# EAGLE design Projeto Lora (EAGLE 9.6.2)
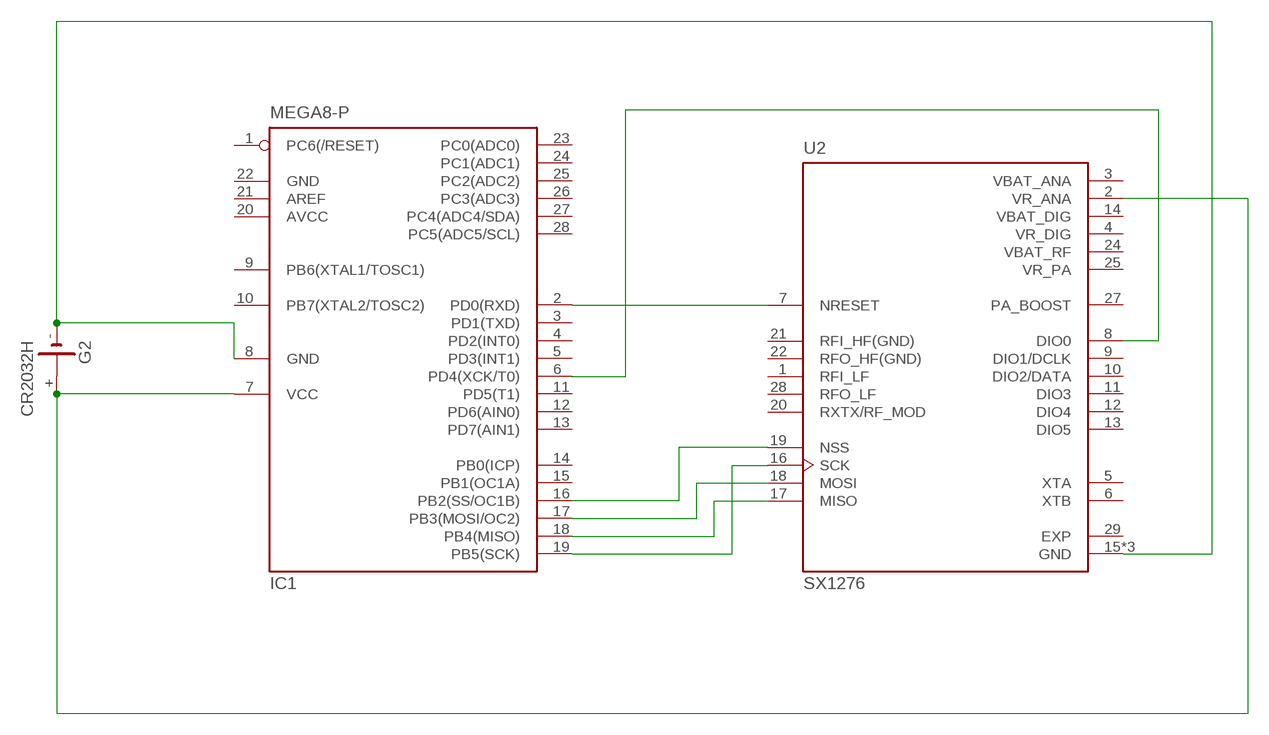
[diagram p0: schematic, sheet 1]

## Parts
G2  CR2032H  [CR2032H]
IC1  MEGA8-P  [DIL28-3]
U2  SX1276  [QFN65P600X600X100-29N]

## Nets
N$1: IC1.18(PB4(MISO)) U2.17(MISO)
N$2: IC1.17(PB3(MOSI/OC2)) U2.18(MOSI)
N$3: IC1.16(PB2(SS/OC1B)) U2.19(NSS)
N$5: IC1.19(PB5(SCK)) U2.16(SCK)
N$8: G2.+ IC1.7(VCC) U2.2(VR_ANA)
N$11: IC1.2(PD0(RXD)) U2.7(NRESET)
N$15: G2.- IC1.8(GND) U2.15(GND) U2.23(GND) U2.26(GND)
N$16: IC1.6(PD4(XCK/T0)) U2.8(DIO0)
Unconnected: G2.+@1(+) IC1.1(PC6(/RESET)) IC1.3(PD1(TXD)) IC1.4(PD2(INT0)) IC1.5(PD3(INT1)) IC1.9(PB6(XTAL1/TOSC1)) IC1.10(PB7(XTAL2/TOSC2)) IC1.11(PD5(T1)) IC1.12(PD6(AIN0)) IC1.13(PD7(AIN1)) IC1.14(PB0(ICP)) IC1.15(PB1(OC1A)) IC1.21(AREF) IC1.23(PC0(ADC0)) IC1.24(PC1(ADC1)) IC1.25(PC2(ADC2)) IC1.26(PC3(ADC3)) IC1.27(PC4(ADC4/SDA)) IC1.28(PC5(ADC5/SCL)) U2.1(RFI_LF) U2.5(XTA) U2.6(XTB) U2.9(DIO1/DCLK) U2.10(DIO2/DATA) U2.11(DIO3) U2.12(DIO4) U2.13(DIO5) U2.20(RXTX/RF_MOD) U2.21(RFI_HF(GND)) U2.22(RFO_HF(GND)) U2.27(PA_BOOST) U2.28(RFO_LF)

## Power pins joined to a net without a drawn wire
AVCC: IC1.20(AVCC)
EXP: U2.29(EXP)
GND: IC1.22(GND)
VBAT_ANA: U2.3(VBAT_ANA)
VBAT_DIG: U2.14(VBAT_DIG)
VBAT_RF: U2.24(VBAT_RF)
VR_DIG: U2.4(VR_DIG)
VR_PA: U2.25(VR_PA)

## Library data of the parts
G2 = battery:CR2032H: LI BATTERY Varta
IC1 = atmel:MEGA8-P: MICROCONTROLLER 8 Kbytes FLASH, 1 kbytes SRAM, 512 bytes EEPROM, USART, 4-channel 10 bit ADC, 2-channel 8 bit ADC Pin compatible with Atmega48, ATMega88, ATMega168 Source: avr.lbr; OC_FARNELL: unknown; OC_NEWARK: unknown
U2 = SX1276:SX1276: RF Transceiver FSK/GFSK/MSK/GMSK/LoRa/OOK 137MHz to 1020MHz 28-Pin QFN Check prices <https://pricing.snapeda.com/parts/SX1276/Semtech%20Corporation/view-part?ref=eda>; AVAILABILITY: In Stock; DESCRIPTION: IC RF TxRx Only 802.15.4 LoRa™ 137MHz ~ 1.02GHz 28-VQFN Exposed Pad; MF: Semtech Corporation; MP: SX1276; PACKAGE: VQFN-28 Semtech Corporation; PRICE: None; PURCHASE-URL: https://pricing.snapeda.com/search/part/SX1276/?ref=eda

## Board
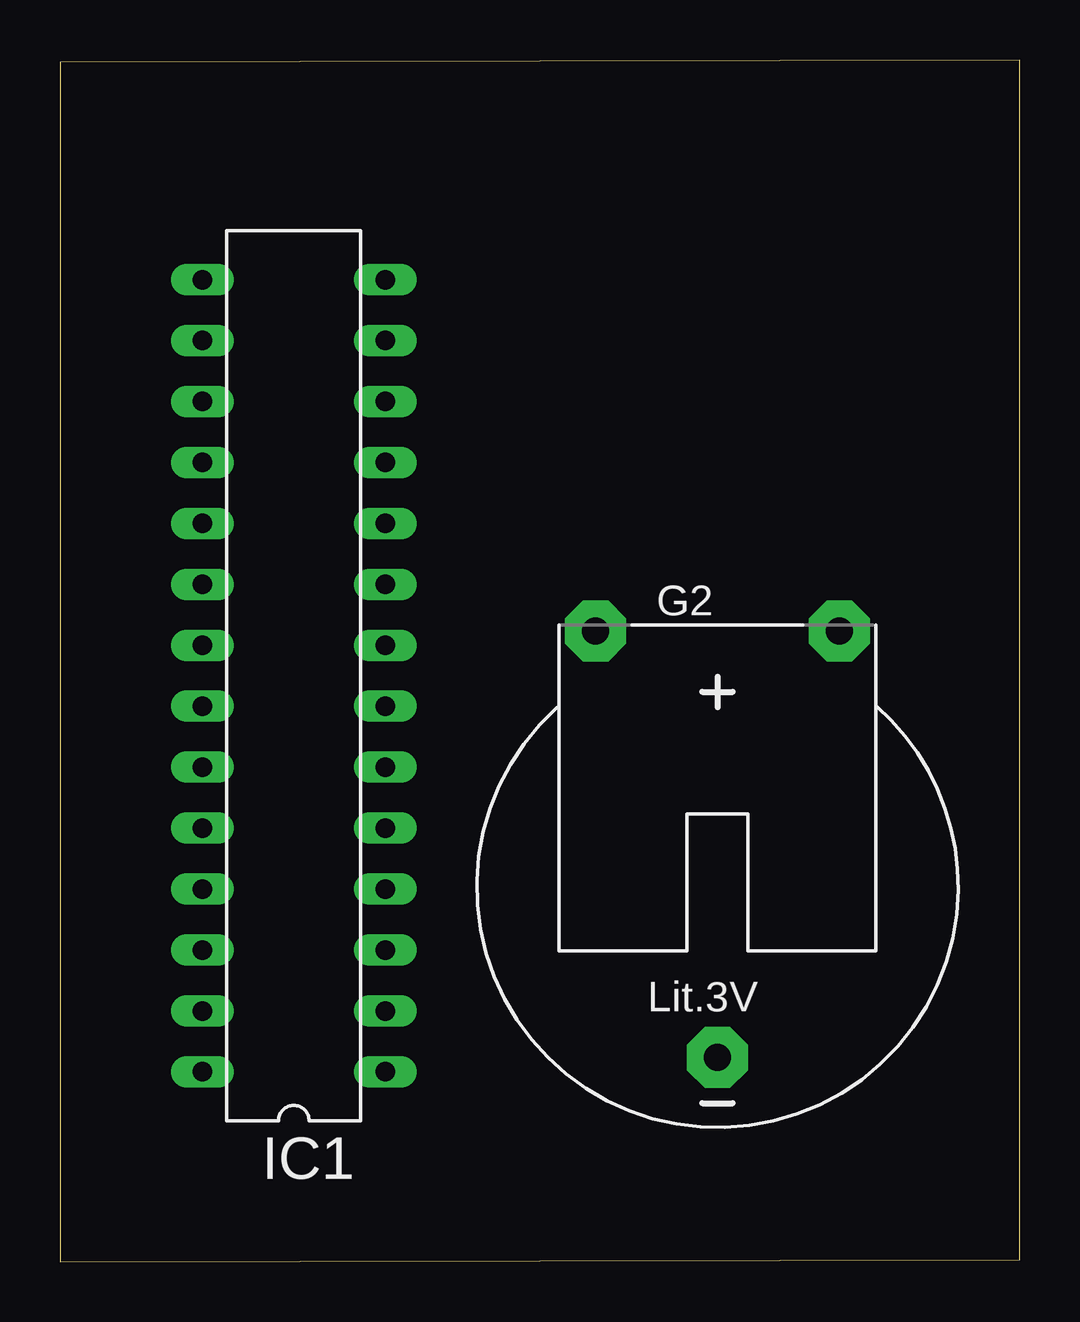
[diagram p1: board, top side]
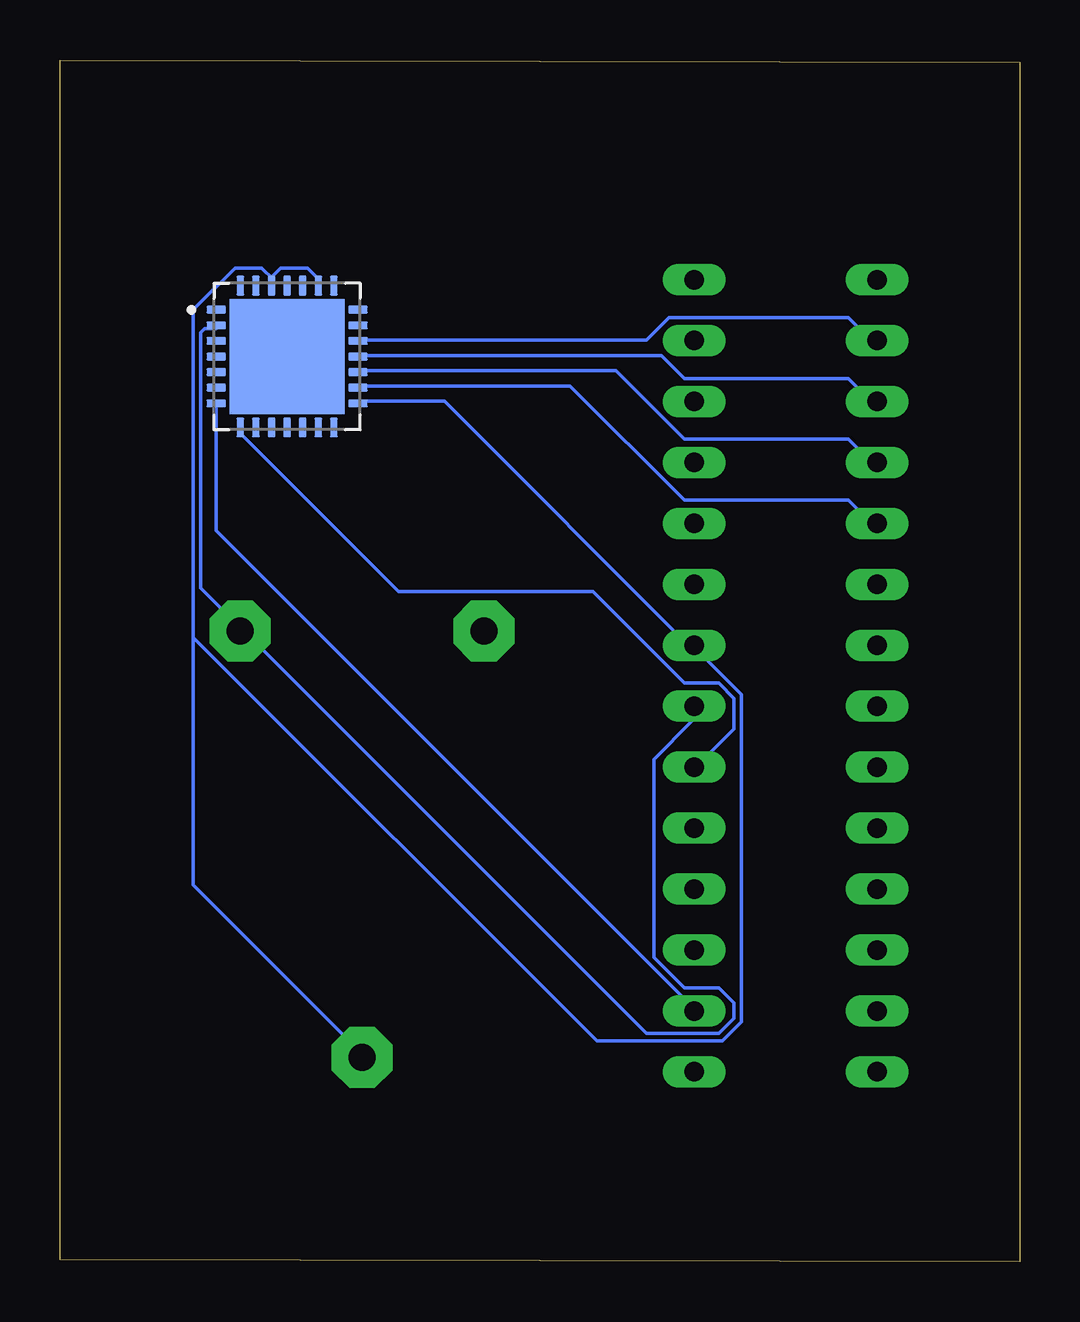
[diagram p2: board, bottom side, seen from below]

Size 40 x 50.1 mm. Coordinates in mm from the lower left corner, seen from the top.
Outline: 0,0 40,0.1 40,50.1 0,50 0,0
Copper layers (1*16): Top 0.035mm / dielectric 1.5mm / Bottom 0.035mm
Design rules "default": minimum track width 6mil, minimum drill 0.35mm, track to track 6mil, track to pad 6mil, pad to pad 6mil, via to via 6mil, smd to smd 6mil, copper to edge 40mil, drill to drill 6mil, minimum pad ring 10mil, minimum via ring 8mil, stop-mask expansion 4mil, vias tented up to drill 0mil, thermal gap 10mil

### Footprints (pad centres in the part's own frame; a part is rotated, then mirrored left to right if it is on the bottom)
CR2032H = drill 1.118 pad 2.54 octagon: + 5.08,10.795; +@1 -5.08,10.795; - 0,-6.985
DIL28-3 = drill 0.813 long: 1 -16.51,-3.81; 2 -13.97,-3.81; 3 -11.43,-3.81; 4 -8.89,-3.81; 5 -6.35,-3.81; 6 -3.81,-3.81; 7 -1.27,-3.81; 8 1.27,-3.81; 9 3.81,-3.81; 10 6.35,-3.81; 11 8.89,-3.81; 12 11.43,-3.81; 13 13.97,-3.81; 14 16.51,-3.81; 15 16.51,3.81; 16 13.97,3.81; 17 11.43,3.81; 18 8.89,3.81; 19 6.35,3.81; 20 3.81,3.81; 21 1.27,3.81; 22 -1.27,3.81; 23 -3.81,3.81; 24 -6.35,3.81; 25 -8.89,3.81; 26 -11.43,3.81; 27 -13.97,3.81; 28 -16.51,3.81
QFN65P600X600X100-29N = smd 0.81 x 0.32: 1 -2.955,1.95; 2 -2.955,1.3; 3 -2.955,0.65; 4 -2.955,0; 5 -2.955,-0.65; 6 -2.955,-1.3; 7 -2.955,-1.95; 15 2.955,-1.95; 16 2.955,-1.3; 17 2.955,-0.65; 18 2.955,0; 19 2.955,0.65; 20 2.955,1.3; 21 2.955,1.95 | smd 0.32 x 0.81: 8 -1.95,-2.955; 9 -1.3,-2.955; 10 -0.65,-2.955; 11 0,-2.955; 12 0.65,-2.955; 13 1.3,-2.955; 14 1.95,-2.955; 22 1.95,2.955; 23 1.3,2.955; 24 0.65,2.955; 25 0,2.955; 26 -0.65,2.955; 27 -1.3,2.955; 28 -1.95,2.955 | smd 4.8 x 4.8: 29 0,0

### Placement (x,y rotation side)
G2  27.41,15.51 0 top
IC1  9.75,24.43 90 top
U2  30.53,37.74 0 bottom

### Tracks (layer width: path | path; a pad name or v marks a point on that pad's centre or on a via)
N$1
  Bottom 0.152: U2.17 27.46,37.15 16.83,37.15 13.97,34.29 7.14,34.29 6.03,33.18 IC1.18
N$2
  Bottom 0.152: U2.18 27.46,37.78 14.92,37.78 13.97,36.83 7.14,36.83 6.03,35.72 IC1.17
N$3
  Bottom 0.152: U2.19 27.46,38.42 15.56,38.42 14.61,39.37 7.14,39.37 6.03,38.26 IC1.16
N$5
  Bottom 0.152: U2.16 27.46,36.51 18.73,36.51 13.97,31.75 7.14,31.75 6.03,30.64 IC1.19
N$8
  Bottom 0.152: 32.38,26.35 34.13,28.1 34.13,38.73 33.97,38.89 33.5,38.89 U2.2 | 32.38,26.35 15.56,9.53 12.54,9.53 11.91,10.16 11.91,10.79 12.54,11.43 13.97,11.43 15.24,12.7 15.24,20.95 13.65,22.54 13.65,23.02 IC1.7 | 32.38,26.35 G2.+
N$11
  Bottom 0.152: U2.7 33.5,35.72 33.5,30.48 13.49,10.48 IC1.2
N$15
  Bottom 0.152: U2.15 27.46,35.88 23.97,35.88 13.65,25.56 IC1.8 13.49,25.56 11.59,23.65 11.59,10 12.38,9.21 17.62,9.21 34.45,26.04 | 31.11,40.96 31.11,40.8 U2.26 31.11,40.96 | 31.11,40.96 31.11,41.12 30.8,41.43 29.69,41.43 29.21,40.96 29.21,40.8 U2.23 | 31.11,40.96 31.59,41.43 32.7,41.43 34.45,39.69 34.45,26.04 | 34.45,26.04 34.45,15.72 27.3,8.57 G2.-
N$16
  Bottom 0.152: U2.8 32.54,34.77 32.54,34.61 25.88,27.94 17.78,27.94 13.97,24.13 12.54,24.13 11.91,23.5 11.91,22.23 13.49,20.64 IC1.6